# Altium project LEDCube_Baseboard_Rev2.PrjPCB
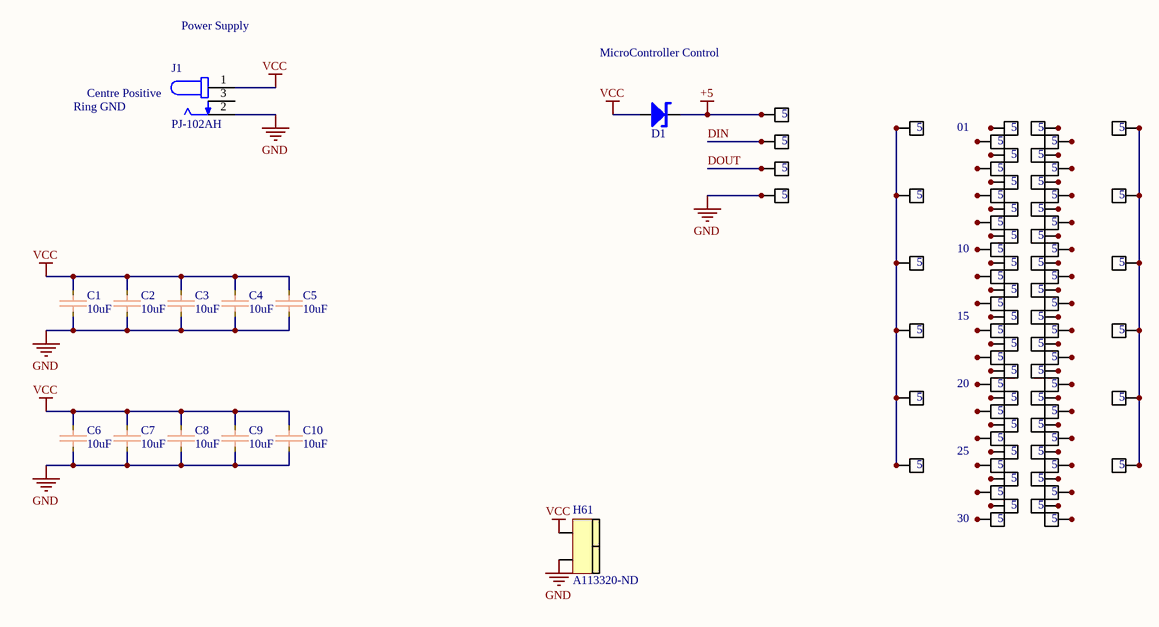
[diagram p0: Baseboard.SchDoc]
1 sheet, 89 parts. Net scope: global (net labels, ports and power ports of the same name join across sheets).
Board file: Baseboard.PcbDoc

## Sheet Baseboard.SchDoc
size A4

### Parts
C1  CAP  [C1206]  (value not drawn)
C2  CAP  [C1206]  (value not drawn)
C3  CAP  [C1206]  (value not drawn)
C4  CAP  [C1206]  (value not drawn)
C5  CAP  [C1206]  (value not drawn)
C6  CAP  [C1206]  (value not drawn)
C7  CAP  [C1206]  (value not drawn)
C8  CAP  [C1206]  (value not drawn)
C9  CAP  [C1206]  (value not drawn)
C10  CAP  [C1206]  (value not drawn)
D1  STPS2L30A  [STPS2L30A]  (value not drawn)
H1  1x5-row  [1x5-row]  (value not drawn)
H2  1x5-row  [1x5-row]  (value not drawn)
H3  1x5-row  [1x5-row]  (value not drawn)
H4  1x5-row  [1x5-row]  (value not drawn)
H5  1x5-row  [1x5-row]  (value not drawn)
H6  1x5-row  [1x5-row]  (value not drawn)
H7  1x5-row  [1x5-row]  (value not drawn)
H8  1x5-row  [1x5-row]  (value not drawn)
H9  1x5-row  [1x5-row]  (value not drawn)
H10  1x5-row  [1x5-row]  (value not drawn)
H11  1x5-row  [1x5-row]  (value not drawn)
H12  1x5-row  [1x5-row]  (value not drawn)
H13  1x5-row  [1x5-row]  (value not drawn)
H14  1x5-row  [1x5-row]  (value not drawn)
H15  1x5-row  [1x5-row]  (value not drawn)
H16  1x5-row  [1x5-row]  (value not drawn)
H17  1x5-row  [1x5-row]  (value not drawn)
H18  1x5-row  [1x5-row]  (value not drawn)
H19  1x5-row  [1x5-row]  (value not drawn)
H20  1x5-row  [1x5-row]  (value not drawn)
H21  1x5-row  [1x5-row]  (value not drawn)
H22  1x5-row  [1x5-row]  (value not drawn)
H23  1x5-row  [1x5-row]  (value not drawn)
H24  1x5-row  [1x5-row]  (value not drawn)
H25  1x5-row  [1x5-row]  (value not drawn)
H26  1x5-row  [1x5-row]  (value not drawn)
H27  1x5-row  [1x5-row]  (value not drawn)
H28  1x5-row  [1x5-row]  (value not drawn)
H29  1x5-row  [1x5-row]  (value not drawn)
H30  1x5-row  [1x5-row]  (value not drawn)
H31  1x5-row  [1x5-row]  (value not drawn)
H32  1x5-row  [1x5-row]  (value not drawn)
H33  1x5-row  [1x5-row]  (value not drawn)
H34  1x5-row  [1x5-row]  (value not drawn)
H35  1x5-row  [1x5-row]  (value not drawn)
H36  1x5-row  [1x5-row]  (value not drawn)
H37  1x5-row  [1x5-row]  (value not drawn)
H38  1x5-row  [1x5-row]  (value not drawn)
H39  1x5-row  [1x5-row]  (value not drawn)
H40  1x5-row  [1x5-row]  (value not drawn)
H41  1x5-row  [1x5-row]  (value not drawn)
H42  1x5-row  [1x5-row]  (value not drawn)
H43  1x5-row  [1x5-row]  (value not drawn)
H44  1x5-row  [1x5-row]  (value not drawn)
H45  1x5-row  [1x5-row]  (value not drawn)
H46  1x5-row  [1x5-row]  (value not drawn)
H47  1x5-row  [1x5-row]  (value not drawn)
H48  1x5-row  [1x5-row]  (value not drawn)
H49  1x5-row  [1x5-row]  (value not drawn)
H50  1x5-row  [1x5-row]  (value not drawn)
H51  1x5-row  [1x5-row]  (value not drawn)
H52  1x5-row  [1x5-row]  (value not drawn)
H53  1x5-row  [1x5-row]  (value not drawn)
H54  1x5-row  [1x5-row]  (value not drawn)
H55  1x5-row  [1x5-row]  (value not drawn)
H56  1x5-row  [1x5-row]  (value not drawn)
H57  1x5-row  [1x5-row]  (value not drawn)
H58  1x5-row  [1x5-row]  (value not drawn)
H59  1x5-row  [1x5-row]  (value not drawn)
H60  1x5-row  [1x5-row]  (value not drawn)
H61  Supplier Part Number 1: A113320-ND  [H_282837-2]  (hidden comment: 282837-2)
H101  1x5-row  [1x5-row]  (value not drawn)
H102  1x5-row  [1x5-row]  (value not drawn)
H103  1x5-row  [1x5-row]  (value not drawn)
H104  1x5-row  [1x5-row]  (value not drawn)
H105  1x5-row  [1x5-row]  (value not drawn)
H106  1x5-row  [1x5-row]  (value not drawn)
H111  1x5-row  [1x5-row]  (value not drawn)
H112  1x5-row  [1x5-row]  (value not drawn)
H113  1x5-row  [1x5-row]  (value not drawn)
H114  1x5-row  [1x5-row]  (value not drawn)
H115  1x5-row  [1x5-row]  (value not drawn)
H116  1x5-row  [1x5-row]  (value not drawn)
H201  1x5-row  [1x5-row]  (value not drawn)
H202  1x5-row  [1x5-row]  (value not drawn)
H203  1x5-row  [1x5-row]  (value not drawn)
H204  1x5-row  [1x5-row]  (value not drawn)
J1  PJ-102AH  [PJ-102AH]

### Nets
+5: D1.K H201.1 H201.2 H201.3 H201.4 H201.5
GND: C1.1(N/A) C2.2(N/A) C3.2(N/A) C4.2(N/A) C5.2(N/A) C6.1(N/A) C7.2(N/A) C8.2(N/A) C9.2(N/A) C10.2(N/A) H61.1 H204.1 H204.2 H204.3 H204.4 H204.5 J1.2
VCC: C1.2(N/A) C2.1(N/A) C3.1(N/A) C4.1(N/A) C5.1(N/A) C6.2(N/A) C7.1(N/A) C8.1(N/A) C9.1(N/A) C10.1(N/A) D1.A H61.2 J1.1
DIN: H202.1 H202.2 H202.3 H202.4 H202.5
DOUT: H203.1 H203.2 H203.3 H203.4 H203.5
NetH1_1: H1.1 H1.2 H1.3 H1.4 H1.5
NetH2_1: H2.1 H2.2 H2.3 H2.4 H2.5
NetH3_1: H3.1 H3.2 H3.3 H3.4 H3.5
NetH4_1: H4.1 H4.2 H4.3 H4.4 H4.5
NetH5_1: H5.1 H5.2 H5.3 H5.4 H5.5
NetH6_1: H6.1 H6.2 H6.3 H6.4 H6.5
NetH7_1: H7.1 H7.2 H7.3 H7.4 H7.5
NetH8_1: H8.1 H8.2 H8.3 H8.4 H8.5
NetH9_1: H9.1 H9.2 H9.3 H9.4 H9.5
NetH10_1: H10.1 H10.2 H10.3 H10.4 H10.5
NetH11_1: H11.1 H11.2 H11.3 H11.4 H11.5
NetH12_1: H12.1 H12.2 H12.3 H12.4 H12.5
NetH13_1: H13.1 H13.2 H13.3 H13.4 H13.5
NetH14_1: H14.1 H14.2 H14.3 H14.4 H14.5
NetH15_1: H15.1 H15.2 H15.3 H15.4 H15.5
NetH16_1: H16.1 H16.2 H16.3 H16.4 H16.5
NetH17_1: H17.1 H17.2 H17.3 H17.4 H17.5
NetH18_1: H18.1 H18.2 H18.3 H18.4 H18.5
NetH19_1: H19.1 H19.2 H19.3 H19.4 H19.5
NetH20_1: H20.1 H20.2 H20.3 H20.4 H20.5
NetH21_1: H21.1 H21.2 H21.3 H21.4 H21.5
NetH22_1: H22.1 H22.2 H22.3 H22.4 H22.5
NetH23_1: H23.1 H23.2 H23.3 H23.4 H23.5
NetH24_1: H24.1 H24.2 H24.3 H24.4 H24.5
NetH25_1: H25.1 H25.2 H25.3 H25.4 H25.5
NetH26_1: H26.1 H26.2 H26.3 H26.4 H26.5
NetH27_1: H27.1 H27.2 H27.3 H27.4 H27.5
NetH28_1: H28.1 H28.2 H28.3 H28.4 H28.5
NetH29_1: H29.1 H29.2 H29.3 H29.4 H29.5
NetH30_1: H30.1 H30.2 H30.3 H30.4 H30.5
NetH31_1: H31.1 H31.2 H31.3 H31.4 H31.5
NetH32_1: H32.1 H32.2 H32.3 H32.4 H32.5
NetH33_1: H33.1 H33.2 H33.3 H33.4 H33.5
NetH34_1: H34.1 H34.2 H34.3 H34.4 H34.5
NetH35_1: H35.1 H35.2 H35.3 H35.4 H35.5
NetH36_1: H36.1 H36.2 H36.3 H36.4 H36.5
NetH37_1: H37.1 H37.2 H37.3 H37.4 H37.5
NetH38_1: H38.1 H38.2 H38.3 H38.4 H38.5
NetH39_1: H39.1 H39.2 H39.3 H39.4 H39.5
NetH40_1: H40.1 H40.2 H40.3 H40.4 H40.5
NetH41_1: H41.1 H41.2 H41.3 H41.4 H41.5
NetH42_1: H42.1 H42.2 H42.3 H42.4 H42.5
NetH43_1: H43.1 H43.2 H43.3 H43.4 H43.5
NetH44_1: H44.1 H44.2 H44.3 H44.4 H44.5
NetH45_1: H45.1 H45.2 H45.3 H45.4 H45.5
NetH46_1: H46.1 H46.2 H46.3 H46.4 H46.5
NetH47_1: H47.1 H47.2 H47.3 H47.4 H47.5
NetH48_1: H48.1 H48.2 H48.3 H48.4 H48.5
NetH49_1: H49.1 H49.2 H49.3 H49.4 H49.5
NetH50_1: H50.1 H50.2 H50.3 H50.4 H50.5
NetH51_1: H51.1 H51.2 H51.3 H51.4 H51.5
NetH52_1: H52.1 H52.2 H52.3 H52.4 H52.5
NetH53_1: H53.1 H53.2 H53.3 H53.4 H53.5
NetH54_1: H54.1 H54.2 H54.3 H54.4 H54.5
NetH55_1: H55.1 H55.2 H55.3 H55.4 H55.5
NetH56_1: H56.1 H56.2 H56.3 H56.4 H56.5
NetH57_1: H57.1 H57.2 H57.3 H57.4 H57.5
NetH58_1: H58.1 H58.2 H58.3 H58.4 H58.5
NetH59_1: H59.1 H59.2 H59.3 H59.4 H59.5
NetH60_1: H60.1 H60.2 H60.3 H60.4 H60.5
NetH101_1: H101.1 H101.2 H101.3 H101.4 H101.5 H102.1 H102.2 H102.3 H102.4 H102.5 H103.1 H103.2 H103.3 H103.4 H103.5 H104.1 H104.2 H104.3 H104.4 H104.5 H105.1 H105.2 H105.3 H105.4 H105.5 H106.1 H106.2 H106.3 H106.4 H106.5
NetH111_1: H111.1 H111.2 H111.3 H111.4 H111.5 H112.1 H112.2 H112.3 H112.4 H112.5 H113.1 H113.2 H113.3 H113.4 H113.5 H114.1 H114.2 H114.3 H114.4 H114.5 H115.1 H115.2 H115.3 H115.4 H115.5 H116.1 H116.2 H116.3 H116.4 H116.5

Not connected (* = marked no-connect by the designer): J1 3

### Notes on the sheet
- Power Supply
- MicroController Control
- Ring GND
- (near J1) Centre Positive
- 01
- 10
- 10uF
- (near C5) 10uF
- 15
- 20
- (near C10) 10uF
- 25
- 30

### Library data of the parts
C1-C10 = CAP: MF: Samsung Electro-Mechanics; MP: CL10B104KA8NNNC; LCSC Part #: C1590; Footprint: 0603
D1 = STPS2L30A: Schottky Diode
H61 = 282837-2: TERM BLK 2P SIDE ENT 5.08MM PCB; Supplier 1: Digi-Key
J1 = PJ-102AH: 2.0 x 6.5 mm, 5.0 A, Horizontal, Through Hole, Tapered Pins, Dc Power Jack Connector; MF: CUI Devices; Digi-Key_Part_Number: CP-102AH-ND; CUI_purchase_URL: https://www.cuidevices.com/product/interconnect/connectors/dc-power-connectors/jacks/pj-102ah?utm_source=snapeda.com&utm_medium=referral&utm_campaign=snapedaBOM; SnapEDA_Link: https://www.snapeda.com/parts/PJ-102AH/CUI%20Devices/view-part/228264/?ref=snap; Package: None; Value: *; Digi-Key_Purchase_URL: https://www.digikey.com/product-detail/en/cui-devices/PJ-102AH/CP-102AH-ND/408448?utm_source=snapeda&utm_medium=aggregator&utm_campaign=symbol; MP: PJ-102AH